# EAGLE design Pyr0-Piezo-FFC-Creality-X-Board (EAGLE 9.3.1)
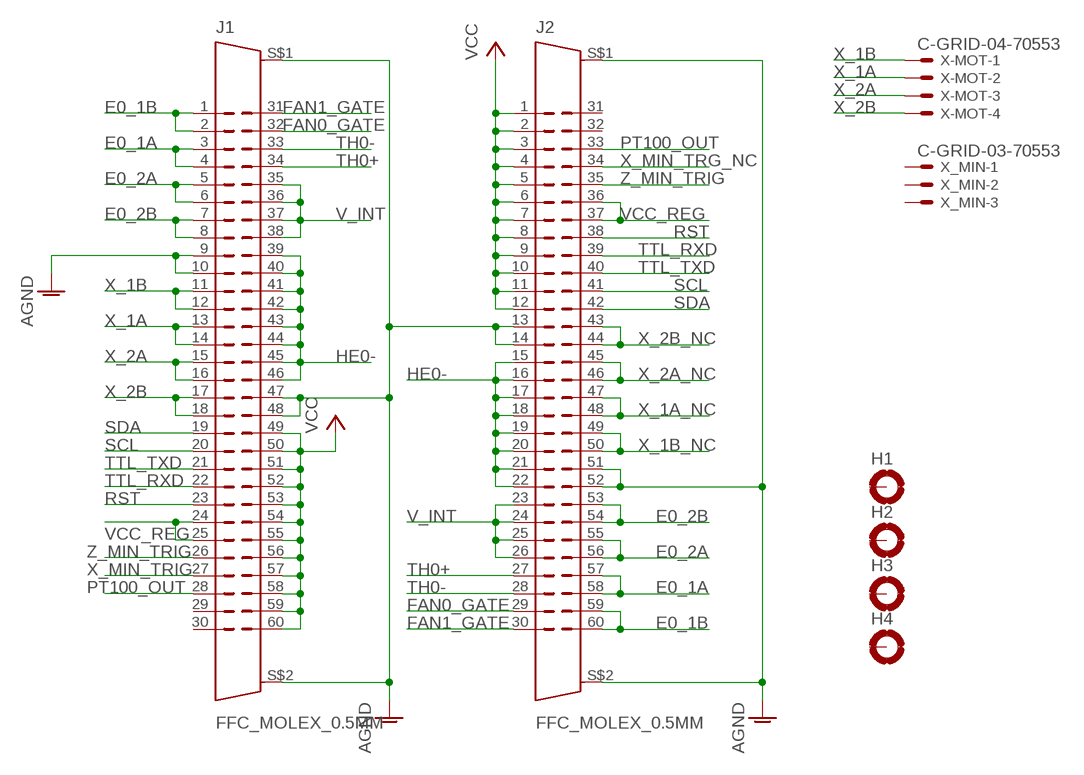
[diagram p0: schematic, sheet 1]

## Parts
H1  HOLES_MOUNT-PAD-ROUND3.2  [HOLES_3,2-PAD]
H2  HOLES_MOUNT-PAD-ROUND3.2  [HOLES_3,2-PAD]
H3  HOLES_MOUNT-PAD-ROUND3.2  [HOLES_3,2-PAD]
H4  HOLES_MOUNT-PAD-ROUND3.2  [HOLES_3,2-PAD]
J1  FFC_MOLEX_0.5MM  [FFC-60P_0.5_MOLEX_505110-6091]
J2  FFC_MOLEX_0.5MM  [FFC-60P_0.5_MOLEX_505110-6091]
X-MOT  C-GRID-04-70553  [70553-04]
X_MIN  C-GRID-03-70553  [70553-03]

## Nets
AGND: J1.9 J1.10 J1.47 J1.48 J1.S$1(S) J1.S$2(S) J2.13 J2.14 J2.51 J2.52 J2.S$1(S) J2.S$2(S)
E0_1A: J1.3 J1.4 J2.57 J2.58
E0_1B: J1.1 J1.2 J2.59 J2.60
E0_2A: J1.5 J1.6 J2.55 J2.56
E0_2B: J1.7 J1.8 J2.53 J2.54
FAN0_GATE: J1.32 J2.29
FAN1_GATE: J1.31 J2.30
HE0-: J1.39 J1.40 J1.41 J1.42 J1.43 J1.44 J1.45 J1.46 J2.15 J2.16 J2.17 J2.18 J2.19 J2.20 J2.21 J2.22
PT100_OUT: J1.28 J2.33
RST: J1.23 J2.38
SCL: J1.20 J2.41
SDA: J1.19 J2.42
TH0+: J1.34 J2.27
TH0-: J1.33 J2.28
TTL_RXD: J1.22 J2.39
TTL_TXD: J1.21 J2.40
V_INT: J1.35 J1.36 J1.37 J1.38 J2.23 J2.24 J2.25 J2.26
VCC: J1.49 J1.50 J1.51 J1.52 J1.53 J1.54 J1.55 J1.56 J1.57 J1.58 J1.59 J1.60 J2.1 J2.2 J2.3 J2.4 J2.5 J2.6 J2.7 J2.8 J2.9 J2.10 J2.11 J2.12
VCC_REG: J1.24 J1.25 J2.36 J2.37
X_1A: J1.13 J1.14 X-MOT.2
X_1A_NC: J2.47 J2.48
X_1B: J1.11 J1.12 X-MOT.1
X_1B_NC: J2.49 J2.50
X_2A: J1.15 J1.16 X-MOT.3
X_2A_NC: J2.45 J2.46
X_2B: J1.17 J1.18 X-MOT.4
X_2B_NC: J2.43 J2.44
X_MIN_TRG_NC: J2.34
X_MIN_TRIG: J1.27
Z_MIN_TRIG: J1.26 J2.35
Unconnected: H1.B3,2(MOUNT) H2.B3,2(MOUNT) H3.B3,2(MOUNT) H4.B3,2(MOUNT) J1.29 J1.30 J2.31 J2.32 X_MIN.1 X_MIN.2 X_MIN.3

## Library data of the parts
H1-H4 = PiezoFFC:HOLES_MOUNT-PAD-ROUND: MOUNTING PAD, round
J1 J2 = PiezoFFC:FFC_MOLEX_0.5MM
X-MOT = PiezoFFC:C-GRID-04: CONNECTOR wire to board 2.54 mm (0.100") pitch header; MF: MOLEX; OC_FARNELL: unknown; OC_NEWARK: unknown
X_MIN = PiezoFFC:C-GRID-03: CONNECTOR wire to board 2.54 mm (0.100") pitch header; MF: MOLEX; OC_FARNELL: unknown; OC_NEWARK: unknown

## Board
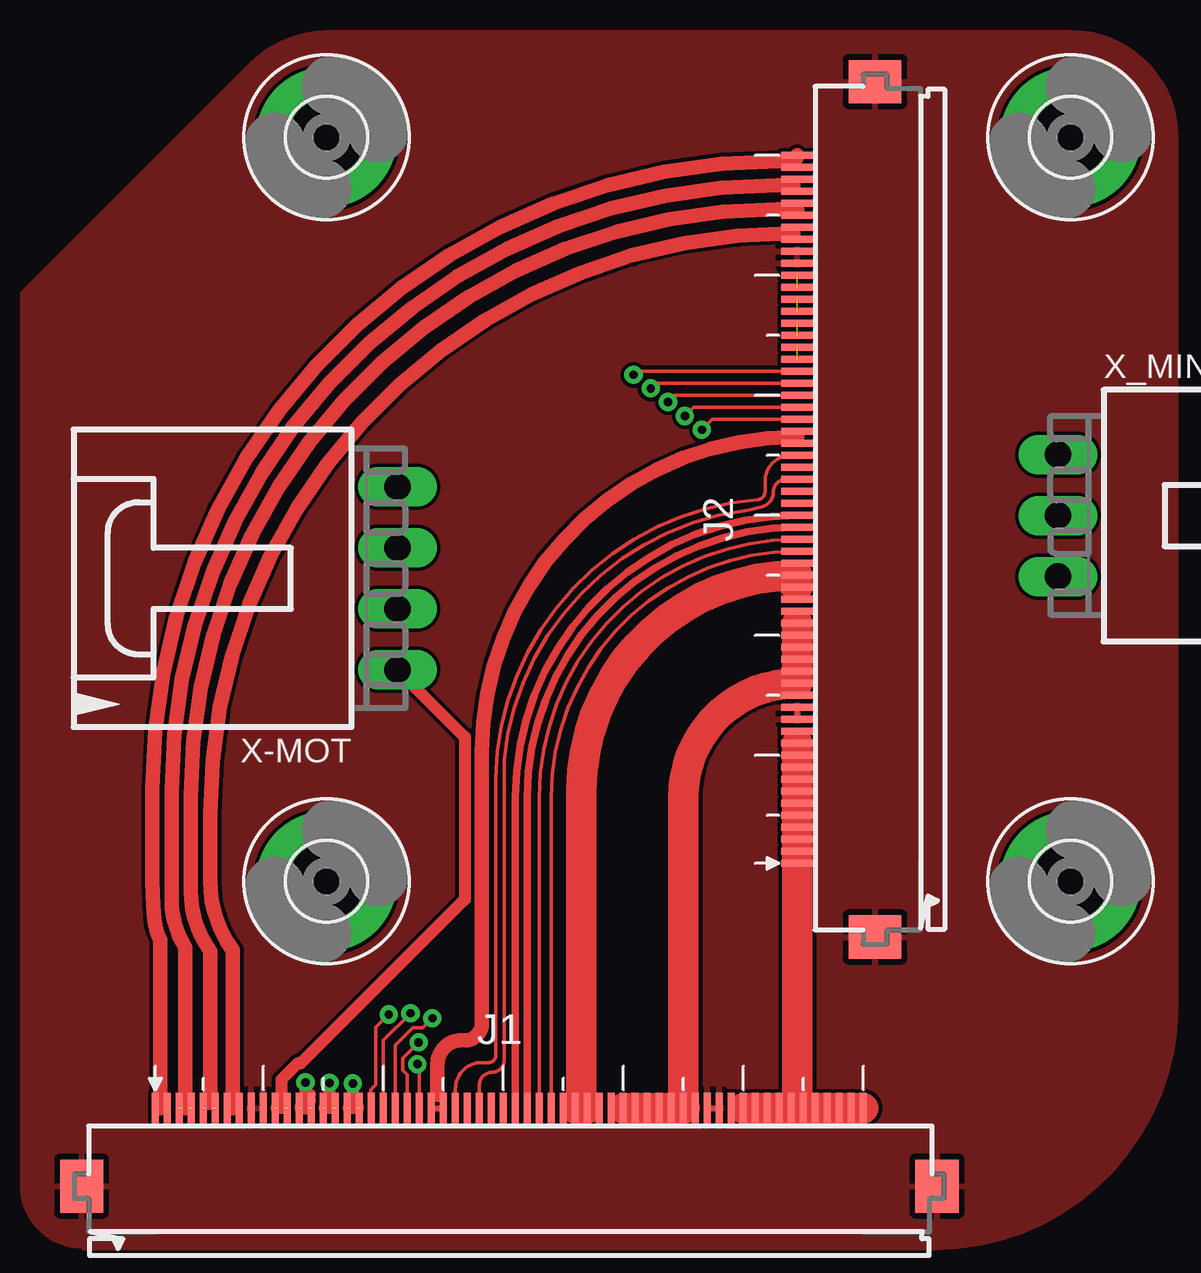
[diagram p1: board, top side]
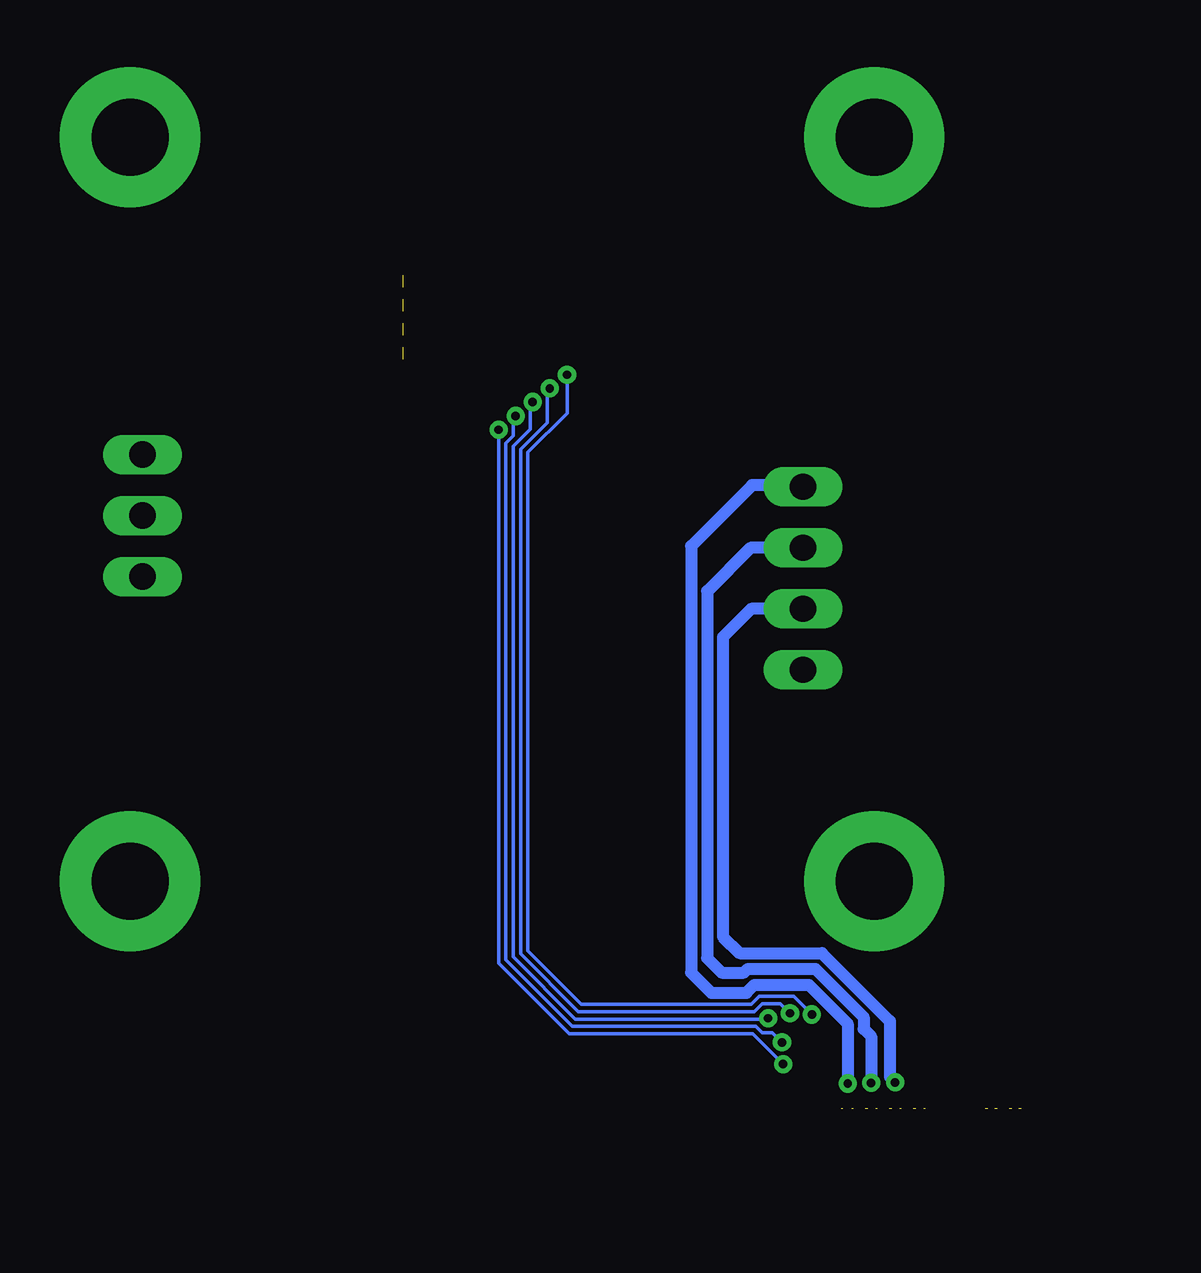
[diagram p2: board, bottom side, seen from below]

No outline drawn. Coordinates in mm, seen from the top.
Copper layers (1*16): Top 0.035mm / dielectric 1.5mm / Bottom 0.035mm
Design rules "default": minimum track width 6mil, minimum drill 0.35mm, track to track 6mil, track to pad 6mil, pad to pad 6mil, via to via 6mil, smd to smd 6mil, copper to edge 40mil, drill to drill 6mil, minimum pad ring 10mil, minimum via ring 8mil, stop-mask expansion 4mil, vias tented up to drill 0mil, thermal gap 10mil

### Footprints (pad centres in the part's own frame; a part is rotated, then mirrored left to right if it is on the bottom)
HOLES_3,2-PAD = drill 3.2 pad 5.842: B3,2 0,0
FFC-60P_0.5_MOLEX_505110-6091 = smd 0.3 x 1.3: 1 -14.75,3.25; 2 -14.25,3.25; 3 -13.75,3.25; 4 -13.25,3.25; 5 -12.75,3.25; 6 -12.25,3.25; 7 -11.75,3.25; 8 -11.25,3.25; 9 -10.75,3.25; 10 -10.25,3.25; 11 -9.75,3.25; 12 -9.25,3.25; 13 -8.75,3.25; 14 -8.25,3.25; 15 -7.75,3.25; 16 -7.25,3.25; 17 -6.75,3.25; 18 -6.25,3.25; 19 -5.75,3.25; 20 -5.25,3.25; 21 -4.75,3.25; 22 -4.25,3.25; 23 -3.75,3.25; 24 -3.25,3.25; 25 -2.75,3.25; 26 -2.25,3.25; 27 -1.75,3.25; 28 -1.25,3.25; 29 -0.75,3.25; 30 -0.25,3.25; 31 0.25,3.25; 32 0.75,3.25; 33 1.25,3.25; 34 1.75,3.25; 35 2.25,3.25; 36 2.75,3.25; 37 3.25,3.25; 38 3.75,3.25; 39 4.25,3.25; 40 4.75,3.25; 41 5.25,3.25; 42 5.75,3.25; 43 6.25,3.25; 44 6.75,3.25; 45 7.25,3.25; 46 7.75,3.25; 47 8.25,3.25; 48 8.75,3.25; 49 9.25,3.25; 50 9.75,3.25; 51 10.25,3.25; 52 10.75,3.25; 53 11.25,3.25; 54 11.75,3.25; 55 12.25,3.25; 56 12.75,3.25; 57 13.25,3.25; 58 13.75,3.25; 59 14.25,3.25; 60 14.75,3.25 | smd 1.8 x 2.2: S$1 17.821,0; S$2 -17.821,0
70553-04 = drill 1.092 long: 1 -3.81,-7.62; 2 -1.27,-7.62; 3 1.27,-7.62; 4 3.81,-7.62
70553-03 = drill 1.092 long: 1 -2.54,-7.62; 2 0,-7.62; 3 2.54,-7.62

### Placement (x,y rotation side)
H1  0,0 0 top
H2  0,31 0 top
H3  31,0 0 top
H4  31,31 0 top
J1  7.62,-12.7 0 top
J2  22.86,15.5 90 top
X-MOT  -4.66,12.62 90 top
X_MIN  38.1,15.24 270 top

### Tracks (layer width: path | path; a pad name or v marks a point on that pad's centre or on a via)
AGND
  Top 0.254: J2.14 J2.13 | J1.47 J1.48
  pour Top: -10.16,-15.24 arc-90 -12.7,-12.7 -12.7,24.52 -3.2,34.02 arc-43 0,35.4 31.05,35.4 arc-90 35.42,31.02 35.42,-5.22 arc-90 25.35,-15.3 -10.12,-15.3 -10.18,-15.25 -10.17,-15.25
E0_1A  (2 unrouted)
  Top 0.152: 19.61,29.2 19.41,29 | -5.74,-9.45 -5.88,-9.45 -6.02,-9.45
  Top 0.254: J2.58 19.61,29.2 J2.57
  Top 0.61: 19.41,29 18.77,29 arc90 -6.45,3.77 -6.45,-0.78 arc32 -5.88,-2.75 -5.88,-9.45
E0_1B
  Top 0.152: -6.92,-9.45 J1.1 J1.2
  Top 0.254: J2.60 J2.59
  Top 0.61: J2.60 arc-90 19.36,30 18.88,30 arc90 -7.25,3.88 -7.25,0.03 arc5 -7.17,-1.55 arc9 -7.1,-1.98 arc16 -6.92,-2.42 -6.92,-9.45
E0_2A  (2 unrouted)
  Top 0.152: -4.85,-9.23 -4.74,-9.34 -4.74,-9.45 -5.02,-9.45
  Top 0.254: J2.56 19.61,27.95 J2.55
  Top 0.61: 19.61,27.95 arc90 19.56,28 18.77,28 arc90 -5.65,3.58 -5.65,-0.37 arc35 -4.85,-2.91 -4.85,-9.23
E0_2B
  Top 0.152: J2.54 19.36,27 | J1.8 -3.74,-9.45 -3.9,-9.45 J1.7
  Top 0.254: J2.54 J2.53
  Top 0.61: 19.36,27 19.35,27 arc90 -4.85,2.8 -4.85,0.05 arc36 -3.9,-2.88 -3.9,-9.45
FAN0_GATE
  Top 0.305: J2.29 arc90 8.37,3.51 J1.32
FAN1_GATE
  Top 0.305: J2.30 arc90 7.87,3.51 J1.31
HE0-
  Top 0.254: J2.15 J2.16 J2.17 J2.18 J2.19 J2.20 J2.21 J2.22 | J1.46 14.93,-9.45 | J1.45 J1.44 J1.43 J1.42 J1.41 J1.40 J1.39
  Top 1.27: J1.40 J1.45 | J1.45 14.93,-9.45 | J2.21 J2.16 arc90 14.87,3.51 J1.45
PT100_OUT
  Top 0.152: J2.33 19.15,16.75 arc90 18.62,16.23 arc-74 18.15,15.6 arc-8 17.43,15.45 arc76 7.4,5.05 7.4,-7.47 arc-90 6.92,-7.95 arc90 6.37,-8.51 J1.28
RST  (via drill 0.35)
  Top 0.152: J2.38 16.08,19.25 v15.64,18.81 | v3.79,-7.62 3.87,-7.7 J1.23
  Bottom 0.152: v15.64,18.81 15.64,-3.4 12.7,-6.35 5.06,-6.35 v3.79,-7.62
SCL  (via drill 0.35)
  Top 0.152: J2.41 13.72,20.75 v13.51,20.54 | v3.5,-5.5 2.37,-6.63 J1.20
  Bottom 0.152: v13.51,20.54 13.62,20.43 13.62,19.11 14.73,18.01 14.73,-3.03 12.32,-5.44 5,-5.44 4.66,-5.1 3.9,-5.1 v3.5,-5.5
SDA  (via drill 0.35)
  Top 0.152: J2.42 12.94,21.25 v12.79,21.11 | v2.6,-5.55 2.06,-6.08 2.06,-8.47 1.85,-8.69 1.85,-8.9 1.87,-8.92 J1.19
  Bottom 0.152: v12.79,21.11 12.79,19.51 14.43,17.88 14.43,-2.9 12.2,-5.13 5.12,-5.13 4.79,-4.8 3.35,-4.8 v2.6,-5.55
TH0+
  Top 0.152: J2.27 arc90 9.37,3.51 J1.34
TH0-
  Top 0.152: J2.28 arc90 8.87,3.51 J1.33
TTL_RXD  (via drill 0.35)
  Top 0.152: v14.94,19.39 15.3,19.75 J2.39 | v3.84,-6.71 3.18,-7.37 3.18,-7.87 3.37,-8.06 J1.22
  Bottom 0.152: v14.94,19.39 15.04,19.29 15.04,18.56 15.34,18.26 15.34,-3.28 15.02,-3.59 14.7,-3.92 12.57,-6.04 4.93,-6.04 4.66,-6.31 4.24,-6.31 v3.84,-6.71
TTL_TXD  (via drill 0.35)
  Top 0.152: J2.40 14.51,20.25 v14.23,19.97 | v4.41,-5.71 4.02,-6.1 3.59,-6.1 2.87,-6.82 J1.21
  Bottom 0.152: v14.23,19.97 14.33,19.87 14.33,18.84 15.04,18.13 15.04,-3.15 12.45,-5.74 4.45,-5.74 v4.41,-5.71
V_INT
  Top 0.254: J2.24 J2.23 | J2.26 19.43,13.07 19.43,12.93 J2.25 | J1.35 J1.36 | J1.37 J1.38
  Top 1.27: J1.37 J1.36 arc90 10.62,-9.2 10.62,3.77 arc-90 J2.25 J2.24 arc90 19.41,12.45
VCC
  Top 0.254: J1.60 J1.59 J1.58 J1.57 J1.56 J1.55 J1.54 J1.53 J1.52 J1.51 J1.50 J1.49 | J2.1 J2.2 J2.3 J2.4 J2.5 J2.6 J2.7 J2.8 J2.9 J2.10 J2.11 J2.12
  Top 1.27: J1.50 J1.55 | J1.55 J1.60 | J2.11 19.61,-9.19 J1.55
VCC_REG
  Top 0.254: J2.36 19.61,18.52 J2.37 | J1.24 J1.25 4.87,-9.14 arc90 4.62,-8.9 | 5.62,-6.62 5.78,-6.62
  Top 0.61: 4.62,-8.9 4.62,-7.62 arc-90 5.62,-6.62 | 5.78,-6.62 arc90 6.47,-5.92 6.47,5.39 arc-90 19.61,18.52
X_1A  (via drill 0.35)  (2 unrouted)
  Top 0.508: v-0.88,-8.38 -0.88,-9.2 -1.07,-9.39 -1.07,-9.45 -0.73,-9.45 -0.73,-9.18 -0.69,-9.13 -0.69,-8.89
  Bottom 0.508: X-MOT.2 5.12,11.36 6.3,10.18 6.3,-2.3 5.61,-2.99 2.17,-2.99 -0.66,-5.83 -0.66,-8.16 v-0.88,-8.38
X_1A_NC  (1 unrouted)
X_1B  (2 unrouted)
  Top 0.508: X-MOT.1 5.76,6.01 5.76,-0.75 -1.08,-7.59 -1.2,-7.59 -1.88,-8.27 -1.88,-9.21 -1.73,-9.35 -1.73,-9.45 -2.07,-9.45
X_1B_NC  (1 unrouted)
X_2A  (via drill 0.35)  (2 unrouted)
  Top 0.508: v0.12,-8.4 0.12,-9.21 0.27,-9.35 0.27,-9.45 -0.07,-9.45
  Bottom 0.508: X-MOT.3 5.16,13.89 6.96,12.09 6.96,-3.2 6.35,-3.81 5.42,-3.81 5.26,-3.65 2.45,-3.65 0.44,-5.66 0.44,-6.15 0.12,-6.46 v0.12,-8.4
X_2A_NC  (1 unrouted)
X_2B  (via drill 0.35)  (2 unrouted)
  Top 0.508: v1.1,-8.43 1.1,-9.18 1.31,-9.39 1.31,-9.45 0.93,-9.45
  Bottom 0.508: X-MOT.4 3.04,16.51 5.08,16.51 7.62,13.97 7.62,-3.81 6.78,-4.65 5.33,-4.65 4.99,-4.31 2.72,-4.31 1.1,-5.93 v1.1,-8.43
X_2B_NC  (1 unrouted)
Z_MIN_TRIG
  Top 0.152: 19.4,17.75 J2.35 19.35,17.75 arc90 18.27,16.68 18.27,16.23 arc-85 17.98,15.9 arc84 7.05,4.3 7.05,-7.28 arc-90 6.78,-7.55 6.47,-7.55 arc90 5.38,-8.65 J1.26 arc-90 J1.26